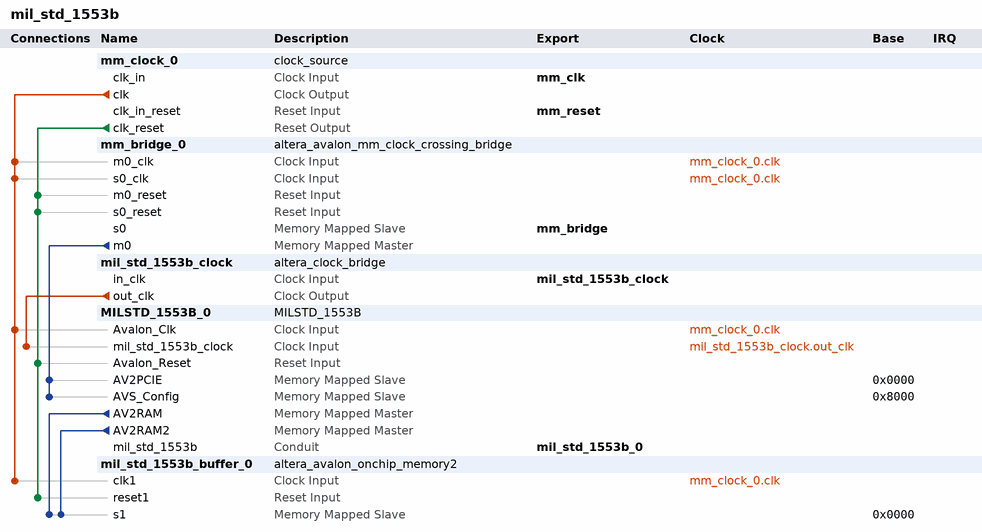
[diagram p0: system contents]
# Platform Designer (Qsys) system mil_std_1553b, Cyclone V 5CGXFC7D6F31I7
# Parameters at their usual value, and those the tool derives, are not listed.
package require -exact qsys 18.1
create_system mil_std_1553b
set_project_property DEVICE_FAMILY {Cyclone V}
set_project_property DEVICE 5CGXFC7D6F31I7

add_instance mm_clock_0 clock_source 18.1
set_instance_parameter_value mm_clock_0 clockFrequency 100000000

add_instance mm_bridge_0 altera_avalon_mm_clock_crossing_bridge 18.1
set_instance_parameter_value mm_bridge_0 ADDRESS_UNITS WORDS
set_instance_parameter_value mm_bridge_0 ADDRESS_WIDTH 14
set_instance_parameter_value mm_bridge_0 COMMAND_FIFO_DEPTH 256
set_instance_parameter_value mm_bridge_0 DATA_WIDTH 32
set_instance_parameter_value mm_bridge_0 MASTER_SYNC_DEPTH 2
set_instance_parameter_value mm_bridge_0 MAX_BURST_SIZE 1
set_instance_parameter_value mm_bridge_0 RESPONSE_FIFO_DEPTH 256
set_instance_parameter_value mm_bridge_0 SLAVE_SYNC_DEPTH 2
set_instance_parameter_value mm_bridge_0 USE_AUTO_ADDRESS_WIDTH 0

add_instance mil_std_1553b_clock altera_clock_bridge 18.1
set_instance_parameter_value mil_std_1553b_clock DERIVED_CLOCK_RATE 0
set_instance_parameter_value mil_std_1553b_clock EXPLICIT_CLOCK_RATE 16000000

add_instance MILSTD_1553B_0 MILSTD_1553B 16.1

add_instance mil_std_1553b_buffer_0 altera_avalon_onchip_memory2 18.1
set_instance_parameter_value mil_std_1553b_buffer_0 dataWidth 32
set_instance_parameter_value mil_std_1553b_buffer_0 dualPort false
set_instance_parameter_value mil_std_1553b_buffer_0 initMemContent false
set_instance_parameter_value mil_std_1553b_buffer_0 initializationFileName onchip_mem.hex
set_instance_parameter_value mil_std_1553b_buffer_0 memorySize 16384

# connections
add_connection mil_std_1553b_clock.out_clk MILSTD_1553B_0.mil_std_1553b_clock clock
add_connection mm_clock_0.clk mil_std_1553b_buffer_0.clk1 clock
add_connection mm_clock_0.clk MILSTD_1553B_0.Avalon_Clk clock
add_connection mm_clock_0.clk mm_bridge_0.m0_clk clock
add_connection mm_clock_0.clk mm_bridge_0.s0_clk clock
add_connection mm_clock_0.clk_reset mil_std_1553b_buffer_0.reset1 reset
add_connection mm_clock_0.clk_reset MILSTD_1553B_0.Avalon_Reset reset
add_connection mm_clock_0.clk_reset mm_bridge_0.m0_reset reset
add_connection mm_clock_0.clk_reset mm_bridge_0.s0_reset reset
add_connection MILSTD_1553B_0.AV2RAM mil_std_1553b_buffer_0.s1 avalon
set_connection_parameter_value MILSTD_1553B_0.AV2RAM/mil_std_1553b_buffer_0.s1 baseAddress 0x0000
add_connection MILSTD_1553B_0.AV2RAM2 mil_std_1553b_buffer_0.s1 avalon
set_connection_parameter_value MILSTD_1553B_0.AV2RAM2/mil_std_1553b_buffer_0.s1 baseAddress 0x0000
add_connection mm_bridge_0.m0 MILSTD_1553B_0.AV2PCIE avalon
set_connection_parameter_value mm_bridge_0.m0/MILSTD_1553B_0.AV2PCIE baseAddress 0x0000
add_connection mm_bridge_0.m0 MILSTD_1553B_0.AVS_Config avalon
set_connection_parameter_value mm_bridge_0.m0/MILSTD_1553B_0.AVS_Config baseAddress 0x8000

# exported interfaces
add_interface mil_std_1553b_0 conduit end
set_interface_property mil_std_1553b_0 EXPORT_OF MILSTD_1553B_0.mil_std_1553b
add_interface mil_std_1553b_clock clock sink
set_interface_property mil_std_1553b_clock EXPORT_OF mil_std_1553b_clock.in_clk
add_interface mm_bridge avalon slave
set_interface_property mm_bridge EXPORT_OF mm_bridge_0.s0
add_interface mm_clk clock sink
set_interface_property mm_clk EXPORT_OF mm_clock_0.clk_in
add_interface mm_reset reset sink
set_interface_property mm_reset EXPORT_OF mm_clock_0.clk_in_reset

set_interconnect_requirement {$system} qsys_mm.clockCrossingAdapter HANDSHAKE
set_interconnect_requirement {$system} qsys_mm.enableEccProtection FALSE
set_interconnect_requirement {$system} qsys_mm.insertDefaultSlave FALSE
set_interconnect_requirement {$system} qsys_mm.maxAdditionalLatency 1

save_system mil_std_1553b.qsys
